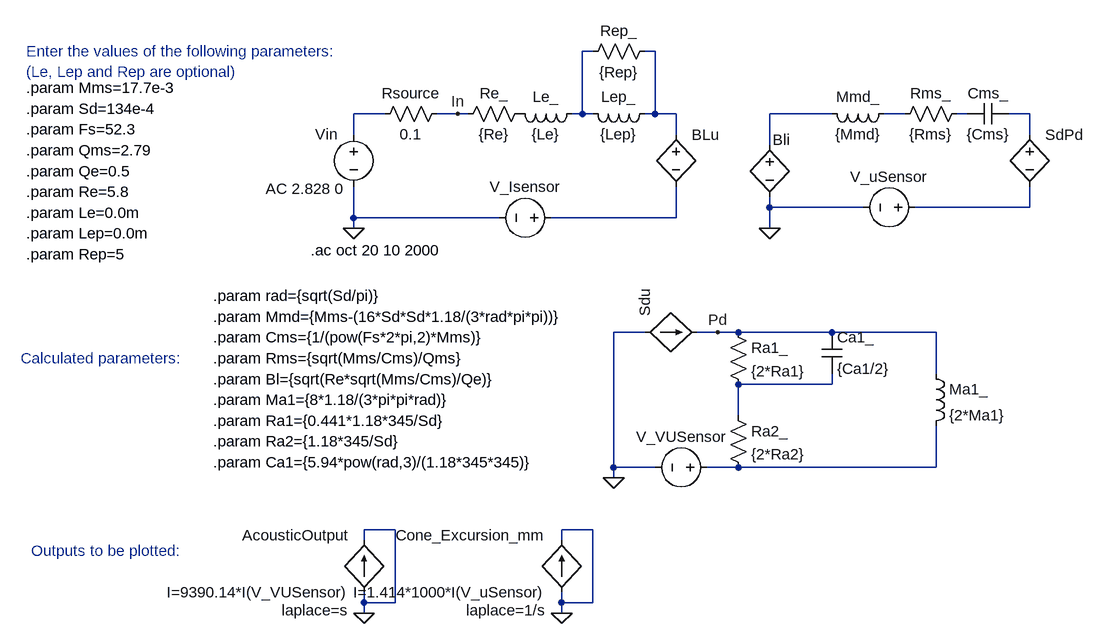
[diagram p0: schematic InfiniteBaffle.asc]
InfiniteBaffle.asc, the LTspice schematic file:
Version 4
SHEET 1 880 680
WIRE -1712 -528 -1712 -560
WIRE -1712 -400 -1712 -448
WIRE -1712 -384 -1712 -400
WIRE -1696 96 -1696 80
WIRE -1696 192 -1696 176
WIRE -1696 208 -1696 192
WIRE -1664 -560 -1712 -560
WIRE -1648 80 -1696 80
WIRE -1648 192 -1696 192
WIRE -1648 192 -1648 80
WIRE -1552 -560 -1584 -560
WIRE -1536 -560 -1552 -560
WIRE -1488 -400 -1712 -400
WIRE -1392 96 -1392 80
WIRE -1392 192 -1392 176
WIRE -1392 208 -1392 192
WIRE -1360 -560 -1376 -560
WIRE -1360 -560 -1360 -656
WIRE -1344 -656 -1360 -656
WIRE -1344 -560 -1360 -560
WIRE -1344 80 -1392 80
WIRE -1344 192 -1392 192
WIRE -1344 192 -1344 80
WIRE -1312 -16 -1312 -224
WIRE -1312 0 -1312 -16
WIRE -1264 -224 -1312 -224
WIRE -1248 -656 -1264 -656
WIRE -1248 -560 -1264 -560
WIRE -1248 -560 -1248 -656
WIRE -1248 -16 -1312 -16
WIRE -1216 -560 -1248 -560
WIRE -1216 -528 -1216 -560
WIRE -1216 -400 -1408 -400
WIRE -1216 -400 -1216 -448
WIRE -1152 -224 -1184 -224
WIRE -1120 -224 -1152 -224
WIRE -1120 -96 -1120 -144
WIRE -1120 -16 -1168 -16
WIRE -1072 -512 -1072 -560
WIRE -1072 -416 -1072 -432
WIRE -1072 -384 -1072 -416
WIRE -976 -560 -1072 -560
WIRE -976 -224 -1120 -224
WIRE -976 -144 -1120 -144
WIRE -976 -144 -976 -160
WIRE -928 -416 -1072 -416
WIRE -864 -560 -896 -560
WIRE -816 -224 -976 -224
WIRE -816 -160 -816 -224
WIRE -816 -16 -1120 -16
WIRE -816 -16 -816 -80
WIRE -768 -560 -784 -560
WIRE -672 -560 -704 -560
WIRE -672 -528 -672 -560
WIRE -672 -416 -848 -416
WIRE -672 -416 -672 -448
FLAG -1712 -384 0
FLAG -1072 -384 0
FLAG -1312 0 0
FLAG -1152 -224 Pd
FLAG -1552 -560 In
FLAG -1696 208 0
FLAG -1392 208 0
SYMBOL voltage -1712 -544 R0
WINDOW 3 24 44 Left 0
WINDOW 123 -135 99 Left 0
WINDOW 39 0 0 Left 0
WINDOW 0 -59 15 Left 0
SYMATTR Value ""
SYMATTR Value2 AC 2.828 0
SYMATTR InstName Vin
SYMBOL res -1440 -576 R90
WINDOW 0 0 56 VBottom 0
WINDOW 3 32 56 VTop 0
SYMATTR InstName Re_
SYMATTR Value {Re}
SYMBOL ind -1360 -576 R90
WINDOW 0 5 56 VBottom 0
WINDOW 3 32 56 VTop 0
SYMATTR InstName Le_
SYMATTR Value {Le}
SYMBOL voltage -1392 -400 R90
WINDOW 0 -32 56 VBottom 0
WINDOW 3 32 56 VTop 0
WINDOW 39 0 0 Left 0
SYMATTR InstName V_Isensor
SYMATTR Value ""
SYMATTR Value2 AC 0
SYMBOL h -1216 -544 R0
WINDOW 3 24 44 Invisible 0
SYMATTR Value V_uSensor
SYMATTR InstName BLu
SYMATTR Value2 {Bl}
SYMBOL h -1072 -528 R0
WINDOW 0 5 8 Left 0
WINDOW 3 24 104 Invisible 0
SYMATTR InstName Bli
SYMATTR Value V_ISensor
SYMATTR Value2 {BL}
SYMBOL ind -880 -576 R90
WINDOW 0 5 56 VBottom 0
WINDOW 3 32 56 VTop 0
SYMATTR InstName Mmd_
SYMATTR Value {Mmd}
SYMBOL res -768 -576 R90
WINDOW 0 0 56 VBottom 0
WINDOW 3 32 56 VTop 0
SYMATTR InstName Rms_
SYMATTR Value {Rms}
SYMBOL cap -704 -576 R90
WINDOW 0 0 32 VBottom 0
WINDOW 3 32 32 VTop 0
SYMATTR InstName Cms_
SYMATTR Value {Cms}
SYMBOL h -672 -544 R0
WINDOW 3 24 104 Invisible 0
SYMATTR Value Pd
SYMATTR InstName SdPd
SYMATTR Prefix E
SYMATTR Value2 0
SYMATTR SpiceLine {Sd}
SYMBOL voltage -832 -416 R90
WINDOW 0 -32 56 VBottom 0
WINDOW 3 32 56 VTop 0
WINDOW 39 0 0 Left 0
SYMATTR InstName V_uSensor
SYMATTR Value ""
SYMATTR Value2 AC 0
SYMBOL f -1264 -224 R270
WINDOW 3 24 88 Invisible 0
SYMATTR Value V_uSensor
SYMATTR InstName Sdu
SYMATTR Value2 {Sd}
SYMBOL res -1136 -240 R0
SYMATTR InstName Ra1_
SYMATTR Value {2*Ra1}
SYMBOL res -1136 -112 R0
SYMATTR InstName Ra2_
SYMATTR Value {2*Ra2}
SYMBOL cap -992 -224 R0
SYMATTR InstName Ca1_
SYMATTR Value {Ca1/2}
SYMBOL ind -832 -176 R0
SYMATTR InstName Ma1_
SYMATTR Value {2*Ma1}
SYMBOL ind -1248 -576 R90
WINDOW 0 5 56 VBottom 0
WINDOW 3 32 56 VTop 0
SYMATTR InstName Lep_
SYMATTR Value {Lep}
SYMBOL res -1360 -640 R270
WINDOW 0 32 56 VTop 0
WINDOW 3 0 56 VBottom 0
SYMATTR InstName Rep_
SYMATTR Value {Rep}
SYMBOL res -1680 -544 R270
WINDOW 0 32 56 VTop 0
WINDOW 3 0 56 VBottom 0
SYMATTR InstName Rsource
SYMATTR Value 0.1
SYMBOL voltage -1152 -16 R90
WINDOW 0 -32 56 VBottom 0
WINDOW 3 32 56 VTop 0
WINDOW 39 0 0 Left 0
SYMATTR InstName V_VUSensor
SYMATTR Value ""
SYMATTR Value2 AC 0
SYMBOL bi -1696 176 R180
WINDOW 0 24 88 Left 0
WINDOW 3 24 0 Left 0
WINDOW 39 24 -28 Left 0
SYMATTR InstName AcousticOutput
SYMATTR Value I=9390.14*I(V_VUSensor)
SYMATTR SpiceLine laplace=s
SYMBOL bi -1392 176 R180
WINDOW 0 24 88 Left 0
WINDOW 3 24 0 Left 0
WINDOW 39 24 -28 Left 0
SYMATTR InstName Cone_Excursion_mm
SYMATTR Value I=1.414*1000*I(V_uSensor)
SYMATTR SpiceLine laplace=1/s
TEXT -1778 -350 Left 0 !.ac oct 20 10 2000
TEXT -1928 -152 Left 0 !.param Bl={sqrt(Re*sqrt(Mms/Cms)/Qe)}
TEXT -2216 -600 Left 0 !.param Mms=17.7e-3
TEXT -1928 -248 Left 0 !.param Mmd={Mms-(16*Sd*Sd*1.18/(3*rad*pi*pi))}
TEXT -2216 -568 Left 0 !.param Sd=134e-4
TEXT -1928 -280 Left 0 !.param rad={sqrt(Sd/pi)}
TEXT -2216 -536 Left 0 !.param Fs=52.3
TEXT -1928 -184 Left 0 !.param Rms={sqrt(Mms/Cms)/Qms}
TEXT -1928 -216 Left 0 !.param Cms={1/(pow(Fs*2*pi,2)*Mms)}
TEXT -2216 -504 Left 0 !.param Qms=2.79
TEXT -2216 -472 Left 0 !.param Qe=0.5
TEXT -2216 -440 Left 0 !.param Re=5.8
TEXT -2216 -408 Left 0 !.param Le=0.0m
TEXT -2216 -376 Left 0 !.param Lep=0.0m
TEXT -2216 -344 Left 0 !.param Rep=5
TEXT -1928 -120 Left 0 !.param Ma1={8*1.18/(3*pi*pi*rad)}
TEXT -1928 -88 Left 0 !.param Ra1={0.441*1.18*345/Sd}
TEXT -1928 -56 Left 0 !.param Ra2={1.18*345/Sd}
TEXT -1928 -24 Left 0 !.param Ca1={5.94*pow(rad,3)/(1.18*345*345)}
TEXT -2224 -184 Left 0 ;Calculated parameters:
TEXT -2216 -656 Left 0 ;Enter the values of the following parameters:\n(Le, Lep and Rep are optional)
TEXT -2208 112 Left 0 ;Outputs to be plotted:

The netlist it stands for:
* InfiniteBaffle.asc
Vin N001 0 AC 2.828 0
Re_ P001 In {Re}
Le_ N002 P001 {Le}
V_Isensor N004 0 AC 0
H§BLu N003 N004 V_uSensor {Bl}
H§Bli N007 0 V_ISensor {BL}
L§Mmd_ N008 N007 {Mmd}
Rms_ N009 N008 {Rms}
Cms_ N010 N009 {Cms}
E§SdPd N010 N011 Pd 0 {Sd}
V_uSensor N011 0 AC 0
F§Sdu 0 Pd V_uSensor {Sd}
Ra1_ Pd N005 {2*Ra1}
Ra2_ N005 N006 {2*Ra2}
Ca1_ Pd N005 {Ca1/2}
L§Ma1_ Pd N006 {2*Ma1}
Lep_ N003 N002 {Lep}
Rep_ N002 N003 {Rep}
Rsource N001 In 0.1
V_VUSensor N006 0 AC 0
B§AcousticOutput 0 0 I=9390.14*I(V_VUSensor) laplace=s
B§Cone_Excursion_mm 0 0 I=1.414*1000*I(V_uSensor) laplace=1/s
.ac oct 20 10 2000
.param Bl={sqrt(Re*sqrt(Mms/Cms)/Qe)}
.param Mms=17.7e-3
.param Mmd={Mms-(16*Sd*Sd*1.18/(3*rad*pi*pi))}
.param Sd=134e-4
.param rad={sqrt(Sd/pi)}
.param Fs=52.3
.param Rms={sqrt(Mms/Cms)/Qms}
.param Cms={1/(pow(Fs*2*pi,2)*Mms)}
.param Qms=2.79
.param Qe=0.5
.param Re=5.8
.param Le=0.0m
.param Lep=0.0m
.param Rep=5
.param Ma1={8*1.18/(3*pi*pi*rad)}
.param Ra1={0.441*1.18*345/Sd}
.param Ra2={1.18*345/Sd}
.param Ca1={5.94*pow(rad,3)/(1.18*345*345)}
* Calculated parameters:
* Enter the values of the following parameters:
* (Le, Lep and Rep are optional)
* Outputs to be plotted:
.backanno
.end